# Altium schematic sheet Sheet_Exp.SchDoc
size A4; SheetNumber: 1; SheetTotal: 1
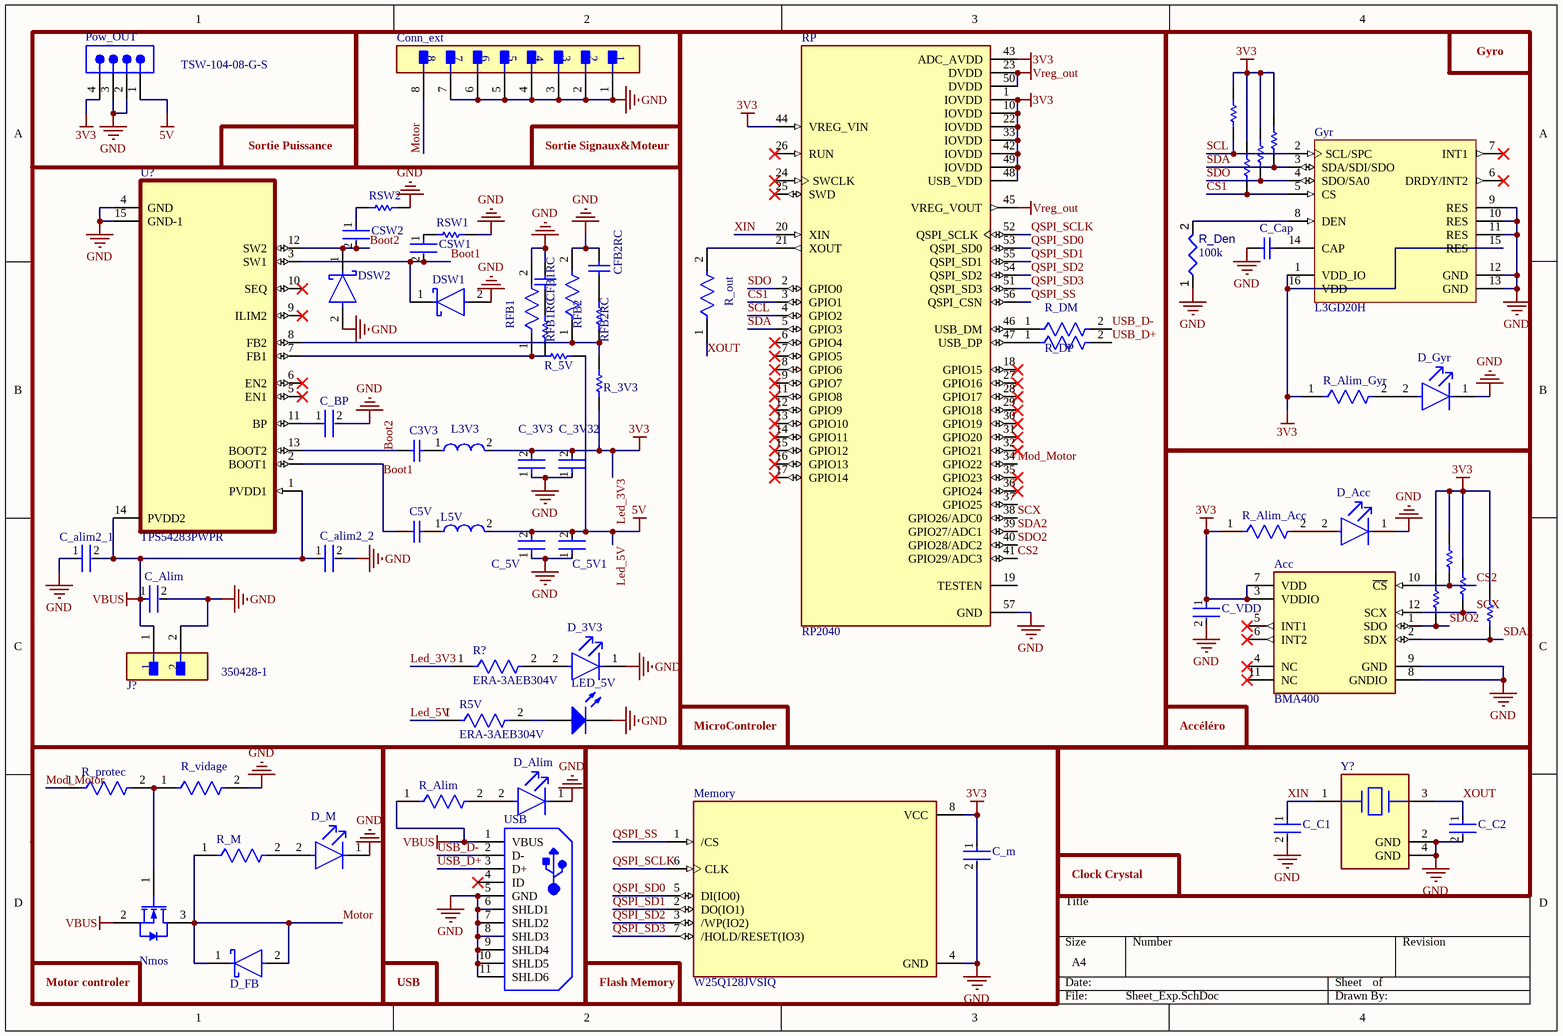
[diagram p0: Sheet_Exp.SchDoc]

## Parts
Acc  BMA400  [FP-BMA400-MFG]
C3V3  GRM219R71H333KA01D  [CAPC2013X95X45NL10T25]  (value not drawn)
C5V  GRM219R71H333KA01D  [CAPC2013X95X45NL10T25]  (value not drawn)
C_3V3  GRM21BR61C106KE15L  [FP-GRM21B-0_1-IPC_C]  (value not drawn)
C_3V32  GRM21BR61C106KE15L  [FP-GRM21B-0_1-IPC_C]  (value not drawn)
C_5V  GRM21BR61C106KE15L  [FP-GRM21B-0_1-IPC_C]  (value not drawn)
C_5V1  GRM21BR61C106KE15L  [FP-GRM21B-0_1-IPC_C]  (value not drawn)
C_Alim  GRM32ER60J107ME20L  [FP-GRM32-0_3-MFG]  (value not drawn)
C_alim2_1  GRM21BR61C106KE15L  [FP-GRM21B-0_1-IPC_C]  (value not drawn)
C_alim2_2  GRM21BR61C106KE15L  [FP-GRM21B-0_1-IPC_C]  (value not drawn)
C_BP  GRM155R60J475ME47D  [FP-GRM155-0_1-IPC_B]  (value not drawn)
C_C1  C0603C270J5GACTU  [FP-C0603C-CF-MFG]  (value not drawn)
C_C2  C0603C270J5GACTU  [FP-C0603C-CF-MFG]  (value not drawn)
C_Cap  GRM188R71H103KA01D  [CAPC1608X90X35ML10T15]  (value not drawn)
C_m  CL10B104KB8NNND  [FP-CL10-IPC_A]  (value not drawn)
C_VDD  CGA3E2X7R1H104K080AA  [FP-CGA3E-0_3-0_1-IPC_A]  (value not drawn)
CFB1RC  GRM188R71H103KA01D  [CAPC1608X90X35ML10T15]  (value not drawn)
CFB2RC  GRM188R71H682KA01D  [CAPC1608X90X35LL10T15]  (value not drawn)
Conn_ext  TSW-108-08-T-S-RA  [FP-TSW-108-08-T-S-RA-MFG]  (value not drawn)
CSW1  C0603C471K5RACTU  [FP-C0603C-CF-MFG]  (value not drawn)
CSW2  C0603C471K5RACTU  [FP-C0603C-CF-MFG]  (value not drawn)
D_3V3  150060RS75000  [FP-150060RS75000-MFG]  (value not drawn)
D_Acc  150060BS75000  [FP-150060BS75000-MFG]  (value not drawn)
D_Alim  150060VS75000  [FP-150060VS75000-MFG]  (value not drawn)
D_FB  SK36B-TP  [FP-DO-214AA-MFG]  (value not drawn)
D_Gyr  150060BS75000  [FP-150060BS75000-MFG]  (value not drawn)
D_M  150060VS75000  [FP-150060VS75000-MFG]  (value not drawn)
DSW1  SK36B-TP  [FP-DO-214AA-MFG]  (value not drawn)
DSW2  SK36B-TP  [FP-DO-214AA-MFG]  (value not drawn)
Gyr  L3GD20H  [STM-LGA-16]
J?  350428-1  [FP-350428-1-MFG]
L3V3  LQH32CN220K23L  [FP-LQH32CH_23-MFG]  (value not drawn)
L5V  LQH32CN220K23L  [FP-LQH32CH_23-MFG]  (value not drawn)
LED_5V  150060YS75000  [0603_A]  (value not drawn)
Memory  W25Q128JVSIQ  [SOIC127P790X216-8N]
Nmos  IRLML0060TRPBF  [INTR-SOT-23-3_V]  (value not drawn)
Pow_OUT  TSW-104-08-G-S  [SMTC-TSW-104-08-X-S]
R5V  ERA-3AEB304V  [FP-ERA3A-IPC_C]
R?  ERA-3AEB304V  [FP-ERA3A-IPC_C]
R_3V3  ERJ-3EKF2002V  [RESC1608X55X30ML15T15]  (value not drawn)
R_5V  ERJ-3EKF2002V  [RESC1608X55X30ML15T15]  (value not drawn)
R_Alim  ERA-3AEB304V  [FP-ERA3A-IPC_C]  (value not drawn)
R_Alim_Acc  ERA-3AEB304V  [FP-ERA3A-IPC_C]  (value not drawn)
R_Alim_Gyr  ERA-3AEB304V  [FP-ERA3A-IPC_C]  (value not drawn)
R_Den  value 100k  [RESC1608X55X25ML10T15]  (hidden comment: Resistor 100k +/-1% 0603 100 mW)
R_DM  ERJ-2RKF27R0X  [FP-ERJ2R-IPC_B]  (value not drawn)
R_DP  ERJ-2RKF27R0X  [FP-ERJ2R-IPC_B]  (value not drawn)
R_M  ERA-3AEB304V  [FP-ERA3A-IPC_C]  (value not drawn)
R_out  ERA-3AEB102V  [FP-ERA3A-IPC_C]  (value not drawn)
R_protec  ERA-3AEB102V  [FP-ERA3A-IPC_C]  (value not drawn)
R_vidage  ERA-3AEB102V  [FP-ERA3A-IPC_C]  (value not drawn)
RCS  ERJ-3EKF4701V  [RESC1608X55X30NL15T15]  (value not drawn)
RCS?  ERJ-3EKF4701V  [RESC1608X55X30NL15T15]  (value not drawn)
RFB1  CRCW06033K83FKEA  [FP-CRCW0603-e3-IPC_C]  (value not drawn)
RFB1RC  ERJ-3EKF4220V  [RESC1608X55X30LL15T15]  (value not drawn)
RFB2  CRCW06036K34FKEA  [FP-CRCW0603-e3-IPC_A]  (value not drawn)
RFB2RC  CRCW0603698RFKEA  [RESC1609X50X30NL10T20]  (value not drawn)
RP  RP2040  [QFN40P700X700X90-57N]
RSCL  ERJ-3EKF4701V  [RESC1608X55X30NL15T15]  (value not drawn)
RSCL?  ERJ-3EKF4701V  [RESC1608X55X30NL15T15]  (value not drawn)
RSDA  ERJ-3EKF4701V  [RESC1608X55X30NL15T15]  (value not drawn)
RSDA?  ERJ-3EKF4701V  [RESC1608X55X30NL15T15]  (value not drawn)
RSDO  ERJ-3EKF4701V  [RESC1608X55X30NL15T15]  (value not drawn)
RSDO?  ERJ-3EKF4701V  [RESC1608X55X30NL15T15]  (value not drawn)
RSW1  ERJ3EKF1002V  [RESC1609X55X30LL15T15]  (value not drawn)
RSW2  ERJ3EKF1002V  [RESC1609X55X30LL15T15]  (value not drawn)
U?  TPS54283PWPR  [IC_TPS27S100BPWPR]
USB  105017-0001  [USB-MICRO-B_V]  (value not drawn)
Y?  ABM8G-12.000MHZ-18-D2Y-T  [FP-ABM8G-MFG]  (value not drawn)

## Blocks framed on the sheet
Sortie Puissance: Pow_OUT
Sortie Signaux&Moteur: Conn_ext
MicroControler: R_DM R_DP R_out RP
Gyro: C_Cap D_Gyr Gyr R_Alim_Gyr R_Den RCS RSCL RSDA RSDO
Accéléro: Acc C_VDD D_Acc R_Alim_Acc RCS? RSCL? RSDA? RSDO?
Motor controler: D_FB D_M Nmos R_M R_protec R_vidage
USB: D_Alim R_Alim USB

## Nets
GND: Acc.8(GNDIO) Acc.9(GND) C_3V3.1 C_3V32.1 C_5V.1 C_5V1.1 C_Alim.2 C_alim2_1.1 C_alim2_2.2 C_BP.2 C_C1.2 C_C2.2 C_Cap.2 C_m.2 C_VDD.2 CFB1RC.1 CFB2RC.2 Conn_ext.1 Conn_ext.2 Conn_ext.3 Conn_ext.4 Conn_ext.5 Conn_ext.6 Conn_ext.7 D_3V3.1(C) D_Acc.1(C) D_Alim.1(C) D_Gyr.1(C) D_M.1(C) DSW1.2(A) DSW2.2(A) Gyr.9(RES) Gyr.10(RES) Gyr.11(RES) Gyr.12(GND) Gyr.13(GND) J?.2 LED_5V.1(K) Memory.4(GND) Pow_OUT.2 Pow_OUT.3 R_Den.1 R_vidage.2 RFB1.2 RFB2.2 RP.57(GND) RSW1.1 RSW2.1 U?.4(GND) U?.15(GND-1) USB.5(GND) USB.6(SHLD1) USB.7(SHLD2) USB.8(SHLD3) USB.9(SHLD4) USB.10(SHLD5) USB.11(SHLD6) Y?.2(GND) Y?.4(GND)
Led_3V3: Acc.3(VDDIO) Acc.7(VDD) C_3V3.2 C_3V32.2 C_m.1 C_VDD.1 Gyr.1(VDD_IO) Gyr.15(RES) Gyr.16(VDD) L3V3.2 Memory.8(VCC) Pow_OUT.4 R?.1 R_3V3.1 R_Alim_Acc.1 R_Alim_Gyr.1 RCS.2 RCS?.2 RP.1(IOVDD) RP.10(IOVDD) RP.22(IOVDD) RP.33(IOVDD) RP.42(IOVDD) RP.43(ADC_AVDD) RP.44(VREG_VIN) RP.48(USB_VDD) RP.49(IOVDD) RSCL.2 RSCL?.2 RSDA.2 RSDA?.2 RSDO.2 RSDO?.2  [also labelled 3V3]
Led_5V: C_5V.2 C_5V1.2 L5V.2 Pow_OUT.1 R5V.1 R_5V.2  [also labelled 5V]
VBUS: C_Alim.1 C_alim2_1.2 C_alim2_2.1 J?.1 Nmos.2(S) R_Alim.1 U?.1(PVDD1) U?.14(PVDD2) USB.1(VBUS)
Vreg_out: RP.23(DVDD) RP.45(VREG_VOUT) RP.50(DVDD)
Boot1: C5V.1 CSW1.2 DSW1.1(C) U?.2(BOOT1) U?.3(SW1)
Boot2: C3V3.1 CSW2.2 DSW2.1(C) U?.12(SW2) U?.13(BOOT2)
CS1: Gyr.5(CS) RCS.1 RP.3(GPIO1)
CS2: Acc.10(~{CS}) RP.41(GPIO29/ADC3) RSCL?.1
Mod_Motor: R_protec.1 RP.34(GPIO22)
Motor: Conn_ext.8 D_FB.1(C) D_FB.2(A) Nmos.3(D) R_M.1
QSPI_SCLK: Memory.6(CLK) RP.52(QSPI_SCLK)
QSPI_SD0: Memory.5(DI(IO0)) RP.53(QSPI_SD0)
QSPI_SD1: Memory.2(DO(IO1)) RP.55(QSPI_SD1)
QSPI_SD2: Memory.3(/WP(IO2)) RP.54(QSPI_SD2)
QSPI_SD3: Memory.7(/HOLD/RESET(IO3)) RP.51(QSPI_SD3)
QSPI_SS: Memory.1(/CS) RP.56(QSPI_CSN)
SCL: Gyr.2(SCL/SPC) RP.4(GPIO2) RSCL.1
SCX: Acc.12(SCX) RCS?.1 RP.38(GPIO26/ADC0)
SDA: Gyr.3(SDA/SDI/SDO) RP.5(GPIO3) RSDA.1
SDA2: Acc.2(SDX) RP.39(GPIO27/ADC1) RSDA?.1
SDO: Gyr.4(SDO/SA0) RP.2(GPIO0) RSDO.1
SDO2: Acc.1(SDO) RP.40(GPIO28/ADC2) RSDO?.1
USB_D+: R_DP.2 USB.3(D+)
USB_D-: R_DM.2 USB.2(D-)
XIN: C_C1.1 RP.20(XIN) Y?.1
XOUT: C_C2.1 R_out.1 Y?.3
NetC3V3_2: C3V3.2 L3V3.1
NetC5V_2: C5V.2 L5V.1
NetC_BP_1: C_BP.1 U?.11(BP)
NetC_Cap_1: C_Cap.1 Gyr.14(CAP)
NetCFB1RC_2: CFB1RC.2 RFB1RC.2
NetCFB2RC_1: CFB2RC.1 RFB2RC.2
NetCSW1_1: CSW1.1 RSW1.2
NetCSW2_1: CSW2.1 RSW2.2
NetD_3V3_2: D_3V3.2(A) R?.2
NetD_Acc_2: D_Acc.2(A) R_Alim_Acc.2
NetD_Alim_2: D_Alim.2(A) R_Alim.2
NetD_Gyr_2: D_Gyr.2(A) R_Alim_Gyr.2
NetD_M_2: D_M.2(A) R_M.2
NetGyr_8: Gyr.8(DEN) R_Den.2
NetLED_5V_2: LED_5V.2(A) R5V.2
NetNmos_1: Nmos.1(G) R_protec.2 R_vidage.1
NetR_3V3_2: R_3V3.2 RFB2.1 RFB2RC.1 U?.8(FB2)
NetR_5V_1: R_5V.1 RFB1.1 RFB1RC.1 U?.7(FB1)
NetR_DM_1: R_DM.1 RP.46(USB_DM)
NetR_DP_1: R_DP.1 RP.47(USB_DP)
NetR_out_2: R_out.2 RP.21(XOUT)

Not connected (* = marked no-connect by the designer): Acc 4(NC)* 5(INT1)* 6(INT2)* 11(NC)*; Gyr 6(DRDY/INT2)* 7(INT1)*; RP 6(GPIO4)* 7(GPIO5)* 8(GPIO6)* 9(GPIO7)* 11(GPIO8)* 12(GPIO9)* 13(GPIO10)* 14(GPIO11)* 15(GPIO12)* 16(GPIO13)* 17(GPIO14)* 18(GPIO15)* 19(TESTEN) 24(SWCLK)* 25(SWD)* 26(RUN)* 27(GPIO16)* 28(GPIO17)* 29(GPIO18)* 30(GPIO19)* 31(GPIO20)* 32(GPIO21)* 35(GPIO23)* 36(GPIO24)* 37(GPIO25); U? 5(EN1)* 6(EN2)* 9(ILIM2)* 10(SEQ)*; USB 4(ID)*

## Notes on the sheet
- Clock Crystal
- (near Memory) Flash Memory

## Library data of the parts
Acc = CMP-191065-000001-1: ACCELEROMETER 2-16G 12LGA; Manufacturer: Bosch Sensortec; Accel Resolution: 12bits; Accel Range: 2/4/8/16g; Accel Sensitivity: 128/256/512/1024LSB/g; Min Supply Voltage: 1.2V; Operating Supply Current: 14.5uA; Accel Axis: X+Y and Z; Sensor Output: I2C,SPI; Max Supply Voltage: 3.6V; Lead Free: Yes; Manufacturer Part Number: BMA400; Ambient Temperature Range High: +85°C; Package: 0; RoHS: TRUE; Device Class L3: Accelerometers; Temperature Range High: +85°C; ComponentLink2URL: https://ae-bst.resource.bosch.com/media/_tech/media/datasheets/BST-BMA400-DS000.pdf; Octopart: https://octopart.com/bma400-bosch+sensortec-106101410; Temperature: -40°C to +85°C; Ambient Temperature Range Low: -40°C; Device Class L1: Sensors; Device Class L2: Motion Sensors; Mouser Description: BMA400 Series 3.6 V ±2g/4g/8g/16g 3 Axes Ultra Low Power Accelerometer - LGA-12; Height: 1mm; Automotive: No; Temperature Range Low: -40°C; ComponentLink2Description: Datasheet; Category: IC; Digikey Description: ACCELEROMETER 2-16G 12LGA
C3V3 C5V = CMP-1036-04169-2: Manufacturer: Murata; Part Number: GRM219R71H333KA01D
C_3V3 C_3V32 C_5V C_5V1 C_alim2_1 C_alim2_2 = CMP-2007-03453-2: Chip Multilayer Ceramic Capacitors for General Purpose, 0805, 10uF, X5R, 15%, 10%, 16V; Radiation Hardening: No; Thickness: 0.053inch; Voltage Rating (DC): 16V; Lead Free: Lead Free; Package Quantity: 1; Width: 1.25mm; Case Code (Imperial): 0805; Depth: 1.25mm; Packaging: Tape and Reel; Dielectric: X5R; Max Operating Temperature: 85°C; Tolerance: 10%; Voltage Rating: 16V; Voltage: 16V; Capacitance: 10uF; Height: 1.25mm; Case Code (Metric): 2012; Material: Ceramic; Mount: Surface Mount; Case/Package: 0805; REACH SVHC: No SVHC; Length: 2mm; Min Operating Temperature: -55°C; Termination: SMD/SMT
C_Alim = CMP-2000-05259-2: CAP CER 100UF 6.3V X5R 1210; 3DS Part Number: 220-00002; Manufacturer: Murata; Temperature Coefficient: 15%; Tolerance: 20%; Octopart: https://octopart.com/grm32er60j107me20l-murata-197007; ComponentLink2URL: https://search.murata.co.jp/Ceramy/image/img/A01X/G101/ENG/GRM32ER60J107ME20-01.pdf; Temperature Range High: +85°C; RoHS: TRUE; Device Class L3: Ceramic Capacitors; Manufacturer Part Number: GRM32ER60J107ME20L; Device Class L2: Capacitors; Voltage: 6.3V; Package: GRM32-0.3; Voltage Rating: 6.3V; Category: Cap; Device Class L1: Passive Components; Temperature Characteristic: X5R; Automotive: No; Digikey Description: CAP CER 100UF 6.3V X5R 1210; Temperature: -55°C to +85°C; Height: 2.7mm; Ipc Land Pattern Name: CAPC320250X250; Capacitance: 100uF; Material: Ceramic; Temperature Range Low: -55°C; Lead Free: Yes; Value: 100uF; ComponentLink2Description: Datasheet
C_BP = CMP-2008-04549-2: Chip Multilayer Ceramic Capacitors for General Purpose, 0402, 4.7uF, X5R, 15%, 20%, 6.3V; Height: 0.5mm; Weight: 0.000212oz; Length: 1mm; Case Code (Metric): 1005; Packaging: Tape and Reel; Termination: SMD/SMT; Dielectric: X5R; Depth: 0.5mm; Case Code (Imperial): 0402; Min Operating Temperature: -55°C; Case/Package: 0402; Voltage: 6.3V; Width: 0.02inch; Capacitance: 4.7uF; Lead Free: Lead Free; Thickness: 0.022inch; Contact Plating: Tin; REACH SVHC: No SVHC; Package Quantity: 10000; Tolerance: 20%; Voltage Rating (DC): 6.3V; Voltage Rating: 6.3V; Mount: Surface Mount; Max Operating Temperature: 85°C
C_C1 C_C2 = CMP-2006-03314-2: CAP CER 27PF 50V C0G/NP0 0603; Manufacturer: KEMET; Tolerance: 0.05; Automotive Grade: Grade 1; Temperature Characteristic: C0G; Temperature Coefficient: 30ppm/°C; RoHS: TRUE; Lead Free: Yes; Automotive: Yes; Material: Ceramic; Category: Cap; Digikey Description: CAP CER 27PF 50V C0G/NP0 0603; Device Class L3: Ceramic Capacitors; Capacitance: 27 pF; Temperature Range High: +125°C; Octopart: https://octopart.com/c0603c270j5gactu-kemet-136059; Value: 27 pF; Temperature Range Low: -55°C; ComponentLink2URL: https://api.kemet.com/component-edge/download/datasheet/C0603C100J5GACAUTO.pdf; Device Class L2: Capacitors; Mouser Description: Multilayer Ceramic Capacitors MLCC - SMD/SMT 50volts 27pF C0G 5%; Device Class L1: Passive Components; ComponentLink2Description: Datasheet; Voltage Rating: 50 V; Package: C0603C-CF; Height: 0.87mm; Temperature: -55°C to +125°C; Manufacturer Part Number: C0603C270J5GACTU
C_Cap CFB1RC = CMP-2100-03642-1: Chip Capacitor, 10 nF, +/- 10%, 50 V, -55 to 125 degC, 0603 (1608 Metric), RoHS, Tape and Reel; Manufacturer: Murata; Insulation Resistance: 10GR; Dielectric: X7R; Voltage Rating: 50V; Capacitance: 10nF; Dielectric Material: Ceramic; Package Quantity: 1; Lead Free: LeadFree; Case/Package: 0603; Termination: SMD/SMT; REACH SVHC: Unknown; Manufacturer URL: http://www.murata.com/; Datasheet URL: http://search.murata.co.jp/Ceramy/image/img/A01X/G101/ENG/GRM188R71H103KA01-01.pdf; Mount: SurfaceMount; Datasheet Version: 42401.0; Number of Pins: 2; Length: 1.6mm; Voltage: 50V; Depth: 0.8mm; Tolerance: 10%; Min Operating Temperature: -55degC; Voltage Rating (DC): 50V; Max Operating Temperature: 125degC; Package Description: 2-Pin Surface Mount Device, Body 1.6 x 0.8 mm; RoHSCompliant: True; Case Code (Imperial): 0603; Width: 0.031inch; Case Code (Metric): 1608; Height: 0.8mm; Package Reference: 0603; Packaging: TapeandReel; Thickness: 0.035inch; Material: Ceramic
C_m = CMP-13271-000587-1: Cap Ceramic 100nF 50V X7R ±10% Pad SMD 0603 +125°C T/R; Case/Package: 0603; Depth: 0.8mm; Max Operating Temperature: 125°C; Lead Free: Lead Free; Material: Ceramic; Voltage Rating: 50V; Min Operating Temperature: -55°C; Voltage Rating (DC): 50V; Dielectric: X7R; Height: 0.8mm; Capacitance: 100nF; Thickness: 0.035inch; Radiation Hardening: No; Voltage: 50V; Packaging: Tape and Reel; Length: 1.6mm; Tolerance: 10%; Width: 0.031inch; Mount: Surface Mount; Package Quantity: 10000
C_VDD = CMP-2000-07546-2: Cap Ceramic 100nF 50V X7R 10% Pad SMD 0603 +125°C Automotive T/R; Weight: 7.1E-05oz; Composition: Ceramic; Max Operating Temperature: 125°C; Termination: SMD/SMT; Dielectric: X7R; Length: 1.6mm; Package Quantity: 1; REACH SVHC: No SVHC; Lead Free: Lead Free; Case Code (Metric): 1608; Min Operating Temperature: -55°C; Packaging: Tape and Reel; Tolerance: 10%; Voltage Rating: 50V; Case Code (Imperial): 0603; Capacitance: 100nF; Case/Package: 0603; Voltage Rating (DC): 50V; Depth: 0.8mm; Radiation Hardening: No; Ratings: AEC-Q200; Mount: Surface Mount; Voltage: 50V; Thickness: 0.035inch; Width: 0.8mm; Height: 0.8mm
CFB2RC = CMP-2006-02934-1: Manufacturer: Murata; Part Number: GRM188R71H682KA01D
Conn_ext = CMP-02766-001402-1: CONN HEADER R/A 8POS 2.54MM; Max Voltage Rating (AC): 450V; Number of Positions: 8; Gender: Male; Connector Type: Male Pin; Max Current Rating: 7.6A; RoHS Compliant: Yes; Contact Material: Bronze; Contact Mating Length: 0.23inch; Series: TSW; Width: 2.54mm; Package Quantity: 1; Housing Color: Black; Contact Plating: Tin; Depth: 9.9mm; Number of Rows: 1; Housing Material: Polyester; Packaging: Bulk; Min Operating Temperature: -55°C; Length: 20.32mm; Pitch: 2.54mm; REACH SVHC: No SVHC; Orientation: Right Angle; Lead Free: Lead Free; Max Operating Temperature: 105°C; Radiation Hardening: No; Contact Type: Male Pin; Termination: Solder; Mount: Through Hole; Color: Black; Number of Contacts: 8
CSW1 CSW2 = CMP-2006-03816-2: CAP CER 470PF 50V X7R 0603; Manufacturer: KEMET; Tolerance: 0.1; Temperature Coefficient: 30ppm/°C; Automotive Grade: Grade 1; Capacitance: 470 pF; Manufacturer Part Number: C0603C471K5RACTU; Temperature Characteristic: X7R; Mouser Description: Ceramic Capacitor, 470Pf, 50V, X7R, 10%, 0603, Full Reel; Material: Ceramic; Height: 0.87mm; Temperature: -55°C to +125°C; RoHS: TRUE; Lead Free: Yes; Category: Cap; ComponentLink2URL: https://api.kemet.com/component-edge/download/datasheet/C0603C100J5GACAUTO.pdf; Device Class L3: Ceramic Capacitors; Temperature Range High: +125°C; Package: C0603C-CF; Automotive: Yes; Device Class L2: Capacitors; Device Class L1: Passive Components; Value: 470 pF; Digikey Description: CAP CER 470PF 50V X7R 0603; Temperature Range Low: -55°C; ComponentLink2Description: Datasheet; Voltage Rating: 50 V; Octopart: https://octopart.com/c0603c471k5ractu-kemet-89311
D_3V3 = CMP-1426-00001-2: LED RED CLEAR 0603 SMD; Luminous Intensity: 250mcd; Viewing Angle: 140°; Dominant Wavelength: 625nm; Test Current: 20mA; Forward Current: 30mA; Forward Voltage: 2V; Lens Color: Colorless; Lens Size: 0.7mm; Width: 0.8mm; Series: WL-SMCW; Color: Red; Min Operating Temperature: -40°C; RoHS Compliant: Yes; Height: 0.8mm; Package Quantity: 1; Packaging: Cut Tape; Mount: Surface Mount; Case/Package: 0603; Lens Transparency: Clear; Length: 1.6mm; Case Code (Imperial): 0603; Lens Style: Clear; Wavelength: 625nm; Max Operating Temperature: 85°C; Case Code (Metric): 1608
D_Acc D_Gyr = CMP-1426-00003-2: LED BLUE CLEAR 0603 SMD; Lens Size: 0.7mm; Luminous Intensity: 145mcd; Forward Voltage: 3.2V; Test Current: 20mA; Dominant Wavelength: 470nm; Lens Color: Colorless; Viewing Angle: 140°; Forward Current: 30mA; Case Code (Imperial): 0603; Lens Transparency: Clear; Length: 1.6mm; Case Code (Metric): 1608; Lens Style: Clear; Color: Blue; Series: WL-SMCW; Wavelength: 470nm; Packaging: Cut Tape; RoHS Compliant: Yes; Package Quantity: 1; Mount: Surface Mount; Max Operating Temperature: 85°C; Min Operating Temperature: -40°C; Width: 0.8mm; Case/Package: 0603; Height: 0.8mm
D_Alim D_M = CMP-1426-00006-5: LED GREEN CLEAR 0603 SMD; Viewing Angle: 140°; Reverse Voltage (DC): 5V; Forward Voltage: 2V; Power Rating: 72mW; Lens Size: 0.7mm; Test Current: 20mA; Lens Color: Colorless; Lens Style: Rectangular; Luminous Intensity: 40mcd; Wavelength: 570nm; Length: 1.6mm; Max Operating Temperature: 85°C; Lens Transparency: Clear; Width: 0.8mm; Mount: Surface Mount; Weight: 0.000882oz; Package Quantity: 4000; Packaging: Cut Tape; RoHS Compliant: Yes; Case/Package: 0603; Series: WL-SMCW; Case Code (Metric): 1608; Illumination Color: Green; Color: Green; Case Code (Imperial): 0603; Forward Current: 20mA; Min Operating Temperature: -40°C; Height: 0.8mm; Dominant Wavelength: 570nm; Number of Pins: 2
D_FB DSW1 DSW2 = CMP-56206-000011-1: DIODE SCHOTTKY 60V 3A DO214AA; Max Surge Current: 100A; Capacitance: 45pF; Max Reverse Current: 20mA; Forward Voltage: 750mV; Max Reverse Leakage Current: 500uA; Polarity: Standard; Element Configuration: Single; Max Repetitive Reverse Voltage (Vrrm): 60V; Current Rating: 3A; Length: 4.57mm; Radiation Hardening: No; Package Quantity: 1; Forward Current: 3A; Voltage Rating (DC): 60V; Case/Package: DO-214AA; Min Operating Temperature: -55°C; Number of Pins: 2; Mount: Surface Mount; Max Forward Surge Current (Ifsm): 100A; RoHS Compliant: Yes; Packaging: Tape and Reel; Max Reverse Voltage (DC): 60V; Max Operating Temperature: 125°C; Width: 3.94mm; Height: 2.44mm; Peak Non-Repetitive Surge Current: 100A; Output Current: 3A; Lead Free: Lead Free; Average Rectified Current: 3A
Gyr = CMP-1771-00002-2: MEMS Motion Sensor: Three-Axis Digital Output Gyroscope, 2.2 to 3.6 V, -40 to 85 degC, 16-Pin LGA, RoHS, Tray; ESR: 200 Ohm; Load Capacitance: 18 pF; Capacitance: 1.8E-11 f; Frequency: 8 MHz; Frequency Tolerance: 20ppm; DatasheetVersion: Rev. 2, 03/2013; ComponentLink1Description: Manufacturer URL; Length: 0.197 inch; Mount: Surface Mount; REACH SVHC: Unknown; ComponentLink2URL: http://www.st.com/content/ccc/resource/technical/document/datasheet/35/b1/e0/39/71/57/43/01/DM00060659.pdf/files/DM00060659.pdf/jcr:content/translations/en.DM00060659.pdf; Min Operating Temperature: -20degC; Height: 0.043 inch; Max Operating Temperature: 70degC; ComponentLink1URL: http://www.st.com/; Case/Package: CSMD; Packaging: Tape and Reel; Width: 0.126 inch; Resistance: 200 Ohm; ComponentLink2Description: Datasheet; Package Quantity: 1000; RoHSCompliant: True; Pins: 4; Tolerance: 20ppm; PackageReference: LGA-16; PackageDescription: 16-Pin Land Grid Array Package, Body 3 x 3 mm, Pitch 0.5 mm
J? = CMP-03369-000080-1: CONN HEADER VERT 2POS 6.35MM; Manufacturer: TE Connectivity; Standoff Height: 0.63mm; Number Of Contacts: 2; Conn Gender: Male; Voltage Rating: 600V; Conn Orientation: Vertical; Current Rating: 12A; Number Of Rows: 1; Mouser Description: Connector, Soft Shell; Universal MATE-N-LOK; 2; Nylon; Natural; 19 A; 600 VAC; Height: 14.99mm; Pitch: 6.35mm; ComponentLink2URL: https://www.te.com/commerce/DocumentDelivery/DDEController?Action=showdoc&DocId=Customer+Drawing%7F350428%7FY2%7Fpdf%7FEnglish%7FENG_CD_350428_Y2.pdf%7F350428-1; Device Class L1: Connectors; Automotive: No; Octopart: https://octopart.com/350428-1-te+connectivity-46505355; Digikey Description: CONN HEADER VERT 2POS 6.35MM; RoHS: TRUE; Temperature: -40°C to +105°C; Contact Material: Gold,Nickel; Package: 350428-1; Temperature Range Low: -40°C; Device Class L3: unset; Lead Free: Yes; Device Class L2: Headers and Wire Housings; Category: Conn; ComponentLink2Description: Datasheet; Temperature Range High: +105°C; Manufacturer Part Number: 350428-1
L3V3 L5V = CMP-06042-007714-2: Wire Wound Ferrite Inductor for Power Lines 22μH ±10% 0.923Ω 250mA 1210; Self Resonant Frequency: 19MHz; Test Frequency: 1MHz; DC Resistance (DCR): 710mR; Inductance: 22uH; Current: 80mA; Shielding: Unshielded; Rated Current-Max: 250mA; Tolerance: 10%; Case Code (Metric): 3225; Max DC Current: 250mA; Length: 3.2mm; Core Material: Ferrite; Max Operating Temperature: 85°C; RoHS Compliant: Yes; Radiation Hardening: No; Min Operating Temperature: -40°C; Lead Free: Lead Free; Weight: 0.002116oz; Termination: SMD/SMT; Width: 2.5mm; Military Standard: Not; Depth: 2.7mm; Frequency: 19MHz; Height: 2mm; Package Quantity: 2000; Case/Package: 1210; Current Rating: 250mA; Case Code (Imperial): 1210; Packaging: Tape and Reel; DC Current: 250mA; Series: LQH32C_23; Mount: Surface Mount
LED_5V = CMP-1426-00005-1: SMD mono-color Chip LED, WL-SMCW, Yellow; Manufacturer: Wuerth Elektronik; ComponentLink1URL: http://www.we-online.com; PartNumber: 150060YS75000; Color: Yellow; ComponentLink2Description: Datasheet; ComponentLink2URL: http://katalog.we-online.com/led/datasheet/150060YS75000.pdf; ComponentLink1Description: Manufacturer URL; PackageReference: 0603_A
Memory = W25Q128JVSIQ: FLASH - NOR Memory IC 128Mb (16M x 8) SPI - Quad I/O, QPI, DTR 133 MHz 8-SOIC; MF: Winbond Electronics; Price: None; Purchase-URL: https://pricing.snapeda.com/search/part/W25Q128JVSIQ/?ref=eda; Check_prices: https://www.snapeda.com/parts/W25Q128JVSIQ/Winbond+Electronics/view-part/?ref=eda; Value: *; MP: W25Q128JVSIQ; Package: SOIC-8 Winbond; SnapEDA_Link: https://www.snapeda.com/parts/W25Q128JVSIQ/Winbond+Electronics/view-part/?ref=snap; Availability: In Stock
Nmos = CMP-2000-06485-1: HEXFET Power MOSFET / , 60 V, 2.7 A, -55 to 150 degC, 3-Pin SOT-23, RoHS, Tape and Reel; Manufacturer: International Rectifier; Maximum Gate Source Voltage: ±16V; Typical Turn On Delay Time: 5.4ns; Number of Elements per Chip: 1; Maximum Power Dissipation: 1.25W; Maximum Continuous Drain Current: 2.7A; Typical Gate Charge @ Vgs: 2.5nC@4.5V; Configuration: Single; Channel Type: N; Forward Transconductance: 7.6S; Channel Mode: Enhancement; Typical Input Capacitance @ Vds: 290pF@25V; Typical TurnOff Delay Time: 6.8ns; Maximum Drain Source Voltage: 60V; Maximum Drain Source Resistance: 92mΩ; Forward Diode Voltage: 1.3V; Length: 3.04mm; Width: 1.4mm; Series: HEXFET®Series; Category: PowerMOSFET; Datasheet Version: 03/2012; Operating Temperature Range: -55to+150°C; Height: 1.02mm; Package Type: Micro8; Mounting Technology: SurfaceMount; Package Reference: SOT-23-3; Datasheet URL: http://www.infineon.com/dgdl/irlml0060pbf.pdf?fileId=5546d462533600a40153566493ef25e6; Mounting Type: SurfaceMount; Maximum Operating Temperature: +150°C; Dimensions: 3.04x1.40x1.02mm; Minimum Operating Temperature: -55°C; Manufacturer URL: http://internationalrectifier.com/; Pin Count: 3; Package Description: 3-Pin Small Outline Transistor, Body 2.92 x 1.3 mm, Pitch 0.95 mm
Pow_OUT = CMP-1024-00357-1: 0.025" SQ Post Header, Through-hole, Vertical, -55 to 125 degC, 2.54 mm Pitch, 4-Pin, Male, RoHS; Manufacturer: Samtec; Pitch: 2.54 mm; RoHS: True; ComponentLink3URL: http://www.samtec.com/documents/webfiles/cpdf/TSW-XXX-XX-XXX-X-XX-XXX-MKT.pdf; Mounting Technology: Through-hole; ComponentLink2URL: http://www.samtec.com/documents/webfiles/pdf/TSW_TH.PDF; ComponentLink1URL: http://www.samtec.com; ComponentLink3Description: Package Specification; PackageVersion: DM, 8/1988; ComponentLink2Description: Datasheet; PackageReference: TSW-104-08-X-S; PackageDescription: .025[0.64] SQ. Post Terminal Strip Assembly; PartNumber: TSW-104-08-G-S; ComponentLink1Description: Manufacturer URL; Temperature Range: -55 to 125 degC; DatasheetVersion: F-214; Orientation: Vertical
R5V R? R_Alim R_Alim_Acc R_Alim_Gyr R_M = CMP-2000-00028-2: RES SMD 300K OHM 0.1% 1/10W 0603; Voltage Rating (DC): 75V; Temperature Coefficient: 25ppm/°C; Resistance: 300kR; Power Rating: 100mW; Technology: THIN FILM; Case/Package: 0603; Width: 0.8mm; Contact Plating: Tin; Case Code (Imperial): 0603; Series: ERA; Construction: Rectangular; Depth: 0.8mm; Resistance Tolerance: 0.1%; Height: 0.45mm; Voltage Rating: 75V; Tolerance: 0.1%; Resistor Type: Thin Film; Max Operating Temperature: 155°C; Length: 1.6mm; Weight: 7.1E-05oz; REACH SVHC: No SVHC; Min Operating Temperature: -55°C; RoHS Compliant: Yes; Radiation Hardening: No; Mount: Surface Mount; Number of Terminations: 2; Size Code: 0603; Packaging: Tape and Reel; Case Code (Metric): 1608; Package Quantity: 5000; Military Standard: Not; Max Power Dissipation: 100mW; Lead Free: Lead Free; Number of Pins: 2; Termination: SMD/SMT
R_3V3 R_5V = CMP-2000-00318-1: Manufacturer: Panasonic; Part Number: ERJ-3EKF2002V
R_Den = CMP-009-00023-5: Chip Resistor, 100 KOhm, +/- 1%, 0.1 W, -55 to 155 degC, 0603 (1608 Metric); Voltage Rating: 50V; Power: 100mW; Max Operating Temperature: 155°C; RoHS Compliant: True; Tolerance: 1%; Pins: 2; Case/Package: 0603; Mounting Technology: SM; Min Operating Temperature: -55°C
R_DM R_DP = CMP-2002-00830-2: RES SMD 27 OHM 1% 1/10W 0402; Voltage Rating: 50V; Temperature Coefficient: 100ppm/°C; Resistance: 27R; Power Rating: 100mW; Military Standard: Not; Construction: Rectangular; Tolerance: 1%; Features: Automotive AEC-Q200; Length: 1mm; Lead Free: Lead Free; Mount: Surface Mount; Number of Terminations: 2; Radiation Hardening: No; Number of Pins: 2; Width: 0.5mm; Contact Plating: Tin; Voltage Rating (DC): 50V; Resistance Tolerance: 1%; Series: ERJ; Packaging: Tape and Reel; Case/Package: 0402; Technology: THICK FILM; REACH SVHC: No SVHC; Depth: 0.5mm; Resistor Type: Thick Film; Package Quantity: 1; Termination: SMD/SMT; Case Code (Imperial): 0402; Height: 0.35mm; Weight: 2.8E-05oz; Max Operating Temperature: 155°C; Case Code (Metric): 1005; Min Operating Temperature: -55°C; RoHS Compliant: Yes; Max Power Dissipation: 100mW
R_out R_protec R_vidage = CMP-2000-00873-2: RES SMD 1K OHM 0.1% 1/10W 0603; Temperature Coefficient: 25ppm/°C; Voltage Rating: 75V; Max Power Dissipation: 100mW; Resistance: 1kR; Technology: METAL FILM; Number of Pins: 2; Packaging: Tape and Reel; Case Code (Imperial): 0603; Case Code (Metric): 1608; Min Operating Temperature: -55°C; REACH SVHC: No SVHC; Length: 1.6mm; Termination: SMD/SMT; Depth: 0.8mm; Resistance Tolerance: 0.1%; Number of Terminations: 2; Width: 0.8mm; Military Standard: Not; Tolerance: 0.1%; Package Quantity: 5000; Contact Plating: Tin; Height: 0.45mm; Construction: Rectangular; Case/Package: 0603; Max Operating Temperature: 155°C; Resistor Type: Thin Film; Series: ERA-3A; Size Code: 0603; RoHS Compliant: Yes; Mount: Surface Mount; Radiation Hardening: No; Power Rating: 100mW
RCS RCS? RSCL RSCL? RSDA RSDA? RSDO RSDO? = CMP-1012-00586-3: Precision Thick Film Chip Resistor, 4.7 KOhm, +/- 1%, -55 to 155 degC, 0603 (1608 Metric), RoHS, Tape and Reel; Resistance: 220 Ohm; Voltage Rating: 50 V; Elements: 4; Case\Package: 1205; Tolerance: 5%; Power Rating: 250 mW; PackageReference: 0603; Max Operating Temperature: 125 degC; REACH SVHC: No SVHC; Width: 0.063 inch; Length: 0.126 inch; Height: 0.024 inch; Mount: Surface Mount; Package Quantity: 1; DatasheetVersion: Apr-15; ComponentLink1Description: Manufacturer URL; Min Operating Temperature: -55 degC; Packaging: Tape and Reel; Radiation Hardening: No; ComponentLink2URL: http://industrial.panasonic.com/cdbs/www-data/pdf/RDA0000/AOA0000C86.pdf; Case Code (Metric): 3216; Pins: 8; Case Code (Imperial): 1206; Type (Resistor): Thick Film; RoHSCompliant: true; ComponentLink2Description: Datasheet; PackageDescription: 2-Pin Surface Mount Device, Body 1.6 x 0.85 mm; ComponentLink1URL: http://www.panasonic.com/
RFB1 = CMP-2000-03310-2: RES Thick Film, 3.83kΩ, 1%, 0.1W, 100ppm/°C, 0603; Resistance: 3.83kR; Max Power Dissipation: 100mW; Voltage Rating (DC): 75V; Case Code (Metric): 1608; Depth: 0.85mm; Military Standard: Not; Length: 1.55mm; Width: 0.85mm; Radiation Hardening: No; Case/Package: 0603; Temperature Coefficient: 100ppm/°C; Tolerance: 1%; Contact Plating: Tin; Max Operating Temperature: 155°C; Power Rating: 100mW; Termination: SMD/SMT; Features: Automotive AEC-Q200; Min Operating Temperature: -55°C; Packaging: Tape and Reel; Number of Pins: 2; Number of Terminations: 2; Package Quantity: 10; Height: 0.45mm; Voltage Rating: 75V; Weight: 7.1E-05oz; Composition: Thick Film; Lead Free: Lead Free; Case Code (Imperial): 0603
RFB1RC = CMP-2000-00493-1: Manufacturer: Panasonic; Part Number: ERJ-3EKF4220V
RFB2 = CMP-2000-03547-2: RES Thick Film, 6.34kΩ, 1%, 0.1W, 100ppm/°C, 0603; Resistance: 6.34kR; Max Power Dissipation: 100mW; Voltage Rating: 75V; Min Operating Temperature: -55°C; Width: 0.033inch; Case/Package: 0603; Contact Plating: Tin; Package Quantity: 10; Radiation Hardening: No; Number of Pins: 2; Depth: 0.85mm; Max Operating Temperature: 155°C; Temperature Coefficient: 100ppm/°C; Termination: SMD/SMT; Height: 0.45mm; Length: 1.55mm; Packaging: Tape and Reel; Case Code (Metric): 1608; Weight: 7.1E-05oz; Composition: Thick Film; Case Code (Imperial): 0603; Military Standard: Not; Number of Terminations: 2; Tolerance: 1%; Power Rating: 100mW; Features: Automotive AEC-Q200
RFB2RC = CMP-1012-00493-2: Manufacturer: Vishay Dale; Part Number: CRCW0603698RFKEA
RP = RP2040: RP2040 chip for Raspberry Pi Pico - ARMÂ® CortexÂ®-M0+ MCU 32-Bit; Check_prices: https://www.snapeda.com/parts/RP2040/Raspberry+Pi/view-part/?ref=eda; Value: *; Availability: In Stock; MP: RP2040; Price: None; Package: None; SnapEDA_Link: https://www.snapeda.com/parts/RP2040/Raspberry+Pi/view-part/?ref=snap; Purchase-URL: https://pricing.snapeda.com/search/part/RP2040/?ref=eda; MF: Raspberry Pi
RSW1 RSW2 = CMP-1012-00623-3: Chip Resistor, 10 KOhm, +/- 1%, 0.1 W, -55 to 155 degC, 0603 (1608 Metric), RoHS, Tape and Reel; Manufacturer: Panasonic; Voltage Rating: 75V; Case\/Package: 0603; Power Rating: 100mW; Resistance: 10KOhm; Temperature Coefficient: 100ppm\/degreesC; Number of Pins: 2; Package Reference: 603; Depth: 0.8mm; Mount: SurfaceMount; Package Description: 2-Pin Surface Mount Device, Body 1.6 x 0.85 mm; Datasheet Version: 02/2017; Length: 1.6mm; Lead Free: LeadFree; Height: 0.45mm; Number of Terminations: 2; Max Power Dissipation: 100mW; Min Operating Temperature: -55degC; Datasheet URL: https://industrial.panasonic.com/cdbs/www-data/pdf/RDA0000/AOA0000C304.pdf; Termination: SMD/SMT; Case Code (Metric): 1608; Case Code (Imperial): 0603; Tolerance: 1%; Max Operating Temperature: 155degC; RoHSCompliant: true; Voltage Rating (DC): 75V; Radiation Hardening: No; Packaging: TapeandReel; Composition: ThickFilm; Mounting Technology: SurfaceMount; Manufacturer URL: http://www.panasonic.com/; Width: 0.031inch; REACH SVHC: NoSVHC; Contact Plating: Tin; Military Standard: Not; Package Quantity: 1
USB = CMP-2000-05827-1: Micro-USB B Receptacle, Right Angle, Bottom Mount, Surface Mount, with Solder Tabs, -30 to 85 degC, 5-Pin USB, RoHS, Tape and Reel; Manufacturer: Molex; Featured Product: Micro-USBConnectorsUSBConnectors; Other Names: WM1399DKR; Package Version: Rev. F, 12/2012; Number of Contacts: 5; Connector Type: USB-microB; Catalog Drawings: 1050170001; 3D Model: 105017-0001.stp; Mating Products: WM17145-ND-CABLEMICROUSBBTOSTDA1.0MWM17147-ND-CABLEMICROUSBBTOSTDA2.0MWM17146-ND-CABLEMICROUSBBTOSTDA1.5M; PCN Assembly/Origin: ResinSupplier21/Oct/2015; Voltage - Max: 30V; Online Catalog: Molex-MicroUSB; Manufacturer URL: http://www.molex.com/; Package Description: 5-Leads USB, Micro B, Body 7.5 x 5 mm, Pitch 0.65 mm; Datasheet URL: http://www.molex.com/elqNow/elqRedir.htm?ref=http://www.molex.com/webdocs/datasheets/pdf/en-us/1050170001_IO_CONNECTORS.pdf; Ingress Protection: -; Datasheet Version: 03/2016; Mounting Type: BoardCutout,SurfaceMount,RightAngle; Circuits: 5; Standard Package: 1; Package Reference: MICRO-B; Package URL: http://www.molex.com/pdm_docs/sd/1050170001_sd.pdf; Category: Connectors,Interconnects; Series: -; RoHS Information: 1050170001CertofCompliance; Features: Shielded,SolderRetention; Family: USB,DVI,HDMIConnectors; Specifications: -; Gender: Receptacle; Packaging: Digi-Reel®; Mounting Technology: SurfaceMount
Y? = CMP-2000-05039-3: Crystal 12MHz ±20ppm (Tol) ±30ppm (Stability) 18pF FUND 120Ω 4-Pin SMD T/R; Series Resistance: 120R; Max Operating Temperature: 85°C; Mount: Surface Mount; Width: 2.5mm; Series: ABM8G; Termination: SMD/SMT; Frequency Tolerance: 20ppm; Tolerance: 20ppm; Min Operating Temperature: -40°C; Operating Frequency: 12 MHz; Depth: 2.5mm; Load Capacitance: 18pF; Number of Pins: 4; Length: 3.2mm; Radiation Hardening: No; Frequency Stability: 30ppm; Height: 1mm; Packaging: Tape and Reel; Package Quantity: 1000; ESR (Equivalent Series Resistance): 120R; Lead Free: Lead Free; Frequency: 12MHz; Case/Package: CSMD
U? = TPS54283PWPR: Package: None; Price: None; Value: *; MP: TPS54283PWPR; Availability: Unavailable